# EAGLE design balanced_detector_pcb (EAGLE 5.06)
COST: 0.14; DIELECTRIC: X7R; MFG: PANASONIC; MPN: ERJ-3EKF2002V; PRICE: 0.15; SHT_NAME: BALANCED DETECTOR; VENDOR: DIGIKEY; VOLTAGE: 50V; VPN: P20.0KHCT-ND
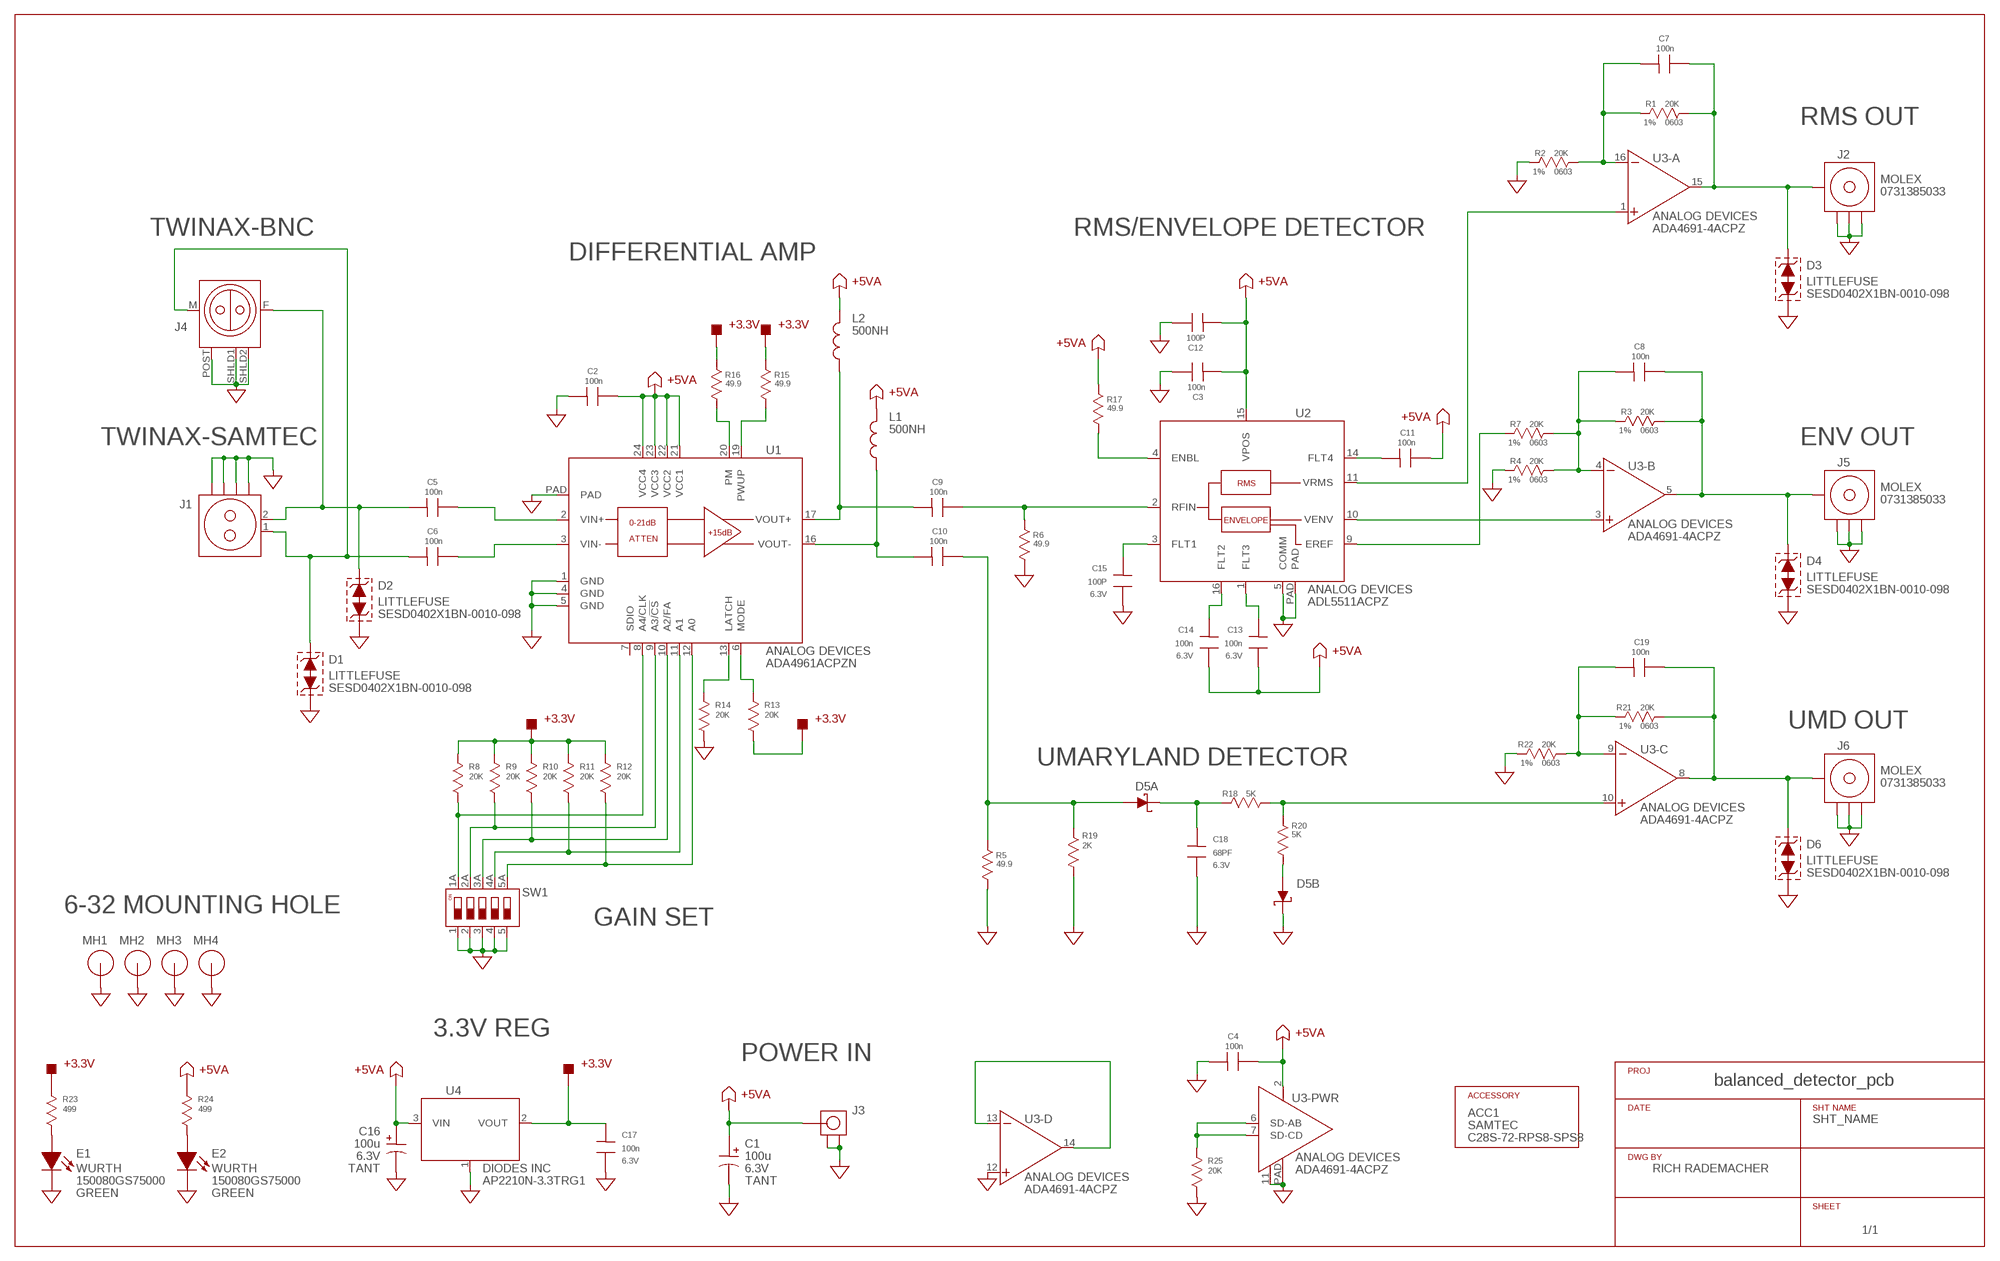
[diagram p0: schematic, sheet 1]
ACC1 (CABLE_SAMTEC_C28S): MFG: SAMTEC; MPN: C28S-72-RPS8-SPS8; VENDOR: SAMTEC; VPN: C28S-72-RPS8-SPS8
U$1 (TITLEBLOCK): AUTHOR: RICH RADEMACHER; DO_NOT_BOM: TRUE; SHT_NAME: SHT_NAME

## Parts
C1  100u  CAP-POL-SIZED  [CAP-SIZE_D/E_EIA7343]
C2  100n  CAP-NP-0603  [R-0603]
C3  100n  CAP-NP-0603  [R-0603]
C4  100n  CAP-NP-0603  [R-0603]
C5  100n  CAP-NP-0603  [R-0603]
C6  100n  CAP-NP-0603  [R-0603]
C7  100n  CAP-NP-0603  [R-0603]
C8  100n  CAP-NP-0603  [R-0603]
C9  100n  CAP-NP-0603  [R-0603]
C10  100n  CAP-NP-0603  [R-0603]
C11  100n  CAP-NP-0603  [R-0603]
C12  100P  CAP-NP-0603  [R-0603]
C13  100n  CAP-NP-0603  [R-0603]
C14  100n  CAP-NP-0603  [R-0603]
C15  100P  CAP-NP-0603  [R-0603]
C16  100u  CAP-POL-SIZED  [CAP-SIZE_D/E_EIA7343]
C17  100n  CAP-NP-0603  [R-0603]
C18  68PF  CAP-NP-0603  [R-0603]
C19  100n  CAP-NP-0603  [R-0603]
D1  TVS_SESD0402  [0402-DFN]
D2  TVS_SESD0402  [0402-DFN]
D3  TVS_SESD0402  [0402-DFN]
D4  TVS_SESD0402  [0402-DFN]
D5  SCHOTTKY-DUAL-BAT15099  [SOT143]
D6  TVS_SESD0402  [0402-DFN]
E1  LED-0805-GRN  [LED-0805]
E2  LED-0805-GRN  [LED-0805]
J1  CONN_TWINAX_CJT  [CJT-T-P-HH-RA-BH1]
J2  CONN_BNC_RA  [MOLEX_0731385033]
J3  CONN_RCA-BLACK-BLK  [CUI_RCJ-02X]
J4  CON-TWINAX-BNC  [TE_5228686-1]
J5  CONN_BNC_RA  [MOLEX_0731385033]
J6  CONN_BNC_RA  [MOLEX_0731385033]
L1  500NH  INDUCTOR-0805HT  [L-0805HT]
L2  500NH  INDUCTOR-0805HT  [L-0805HT]
MH1  MTG-HOLE  [MTG-4-40]
MH2  MTG-HOLE  [MTG-4-40]
MH3  MTG-HOLE  [MTG-4-40]
MH4  MTG-HOLE  [MTG-4-40]
R1  20K  RESISTOR-0603  [R-0603]
R2  20K  RESISTOR-0603  [R-0603]
R3  20K  RESISTOR-0603  [R-0603]
R4  20K  RESISTOR-0603  [R-0603]
R5  49.9  RESISTOR-0603  [R-0603]
R6  49.9  RESISTOR-0603  [R-0603]
R7  20K  RESISTOR-0603  [R-0603]
R8  20K  RESISTOR-0603  [R-0603]
R9  20K  RESISTOR-0603  [R-0603]
R10  20K  RESISTOR-0603  [R-0603]
R11  20K  RESISTOR-0603  [R-0603]
R12  20K  RESISTOR-0603  [R-0603]
R13  20K  RESISTOR-0603  [R-0603]
R14  20K  RESISTOR-0603  [R-0603]
R15  49.9  RESISTOR-0603  [R-0603]
R16  49.9  RESISTOR-0603  [R-0603]
R17  49.9  RESISTOR-0603  [R-0603]
R18  5K  RESISTOR-0603  [R-0603]
R19  2K  RESISTOR-0603  [R-0603]
R20  5K  RESISTOR-0603  [R-0603]
R21  20K  RESISTOR-0603  [R-0603]
R22  20K  RESISTOR-0603  [R-0603]
R23  499  RESISTOR-0603  [R-0603]
R24  499  RESISTOR-0603  [R-0603]
R25  20K  RESISTOR-0603  [R-0603]
SW1  SW-DIP-5PIN  [CTS_219-5MST]
U1  AMP_ADA4961  [LFCSP_24]
U2  DET_ADL5511  [LFCSP_16]
U3  OPAMP_ADA4691-4  [LFCSP_16]
U4  REG_AP2210_3.3V  [SOT23-3]

## Nets
+3.3V: C17.A R8.B R9.B R10.B R11.B R12.B R13.A R15.A R16.A R23.B U4.2(VOUT)
+5VA: C1.+ C2.B C3.A C4.B C11.B C12.A C13.B C14.B C16.+ J3.PIN L1.2 L2.2 R17.A R24.B U1.21(VCC1) U1.22(VCC2) U1.23(VCC3) U1.24(VCC4) U2.15(VPOS) U3.2(-PWR:V+) U4.3(VIN)
AGND: C1.- C2.A C3.B C4.A C12.B C15.B C16.- C17.B C18.B D1.2 D2.2 D3.2 D4.2 D5.3(B:K) D6.2 E1.K E2.K J1.GND1(GND) J1.GND2(GND) J1.GND3(GND) J1.GND4(GND) J2.GND J2.GND@1(GND) J2.GND@2(GND) J3.GND@1 J3.GND@2 J4.POST(GND) J4.SHLD1(GND) J4.SHLD2(GND) J5.GND J5.GND@1(GND) J5.GND@2(GND) J6.GND J6.GND@1(GND) J6.GND@2(GND) MH1.P$1 MH2.P$1 MH3.P$1 MH4.P$1 R2.A R4.A R5.B R6.B R14.A R19.B R22.A R25.A SW1.1 SW1.2 SW1.3 SW1.4 SW1.5 U1.1(GND) U1.4(GND) U1.5(GND) U1.PAD U2.5(COMM) U2.PAD U3.11(-PWR:V-) U3.12(-D:+IN) U3.PAD(-PWR:PAD) U4.1(GND)
N$1: C6.B U1.3(VIN-)
N$2: C5.B U1.2(VIN+)
N$3: C5.A D2.1 J1.2 J4.F
N$4: C6.A D1.1 J1.1 J4.M
N$5: C7.B D3.1 J2.PIN R1.B U3.15(-A:OUT)
N$6: C8.B D4.1 J5.PIN R3.B U3.5(-B:OUT)
N$7: U2.10(VENV) U3.3(-B:+IN)
N$8: U3.13(-D:-IN) U3.14(-D:OUT)
N$9: C19.A R21.A R22.B U3.9(-C:-IN)
N$10: U2.11(VRMS) U3.1(-A:+IN)
N$11: C8.A R3.A R4.B R7.B U3.4(-B:-IN)
N$12: C7.A R1.A R2.B U3.16(-A:-IN)
N$13: C9.B R6.A U2.2(RFIN)
N$14: C9.A L2.1 U1.17(VOUT+)
N$15: C10.A L1.1 U1.16(VOUT-)
N$16: C10.B D5.4(A:A) R5.A R19.A
N$17: R8.A SW1.1A U1.8(A4/CLK)
N$18: C11.A U2.14(FLT4)
N$19: R7.A U2.9(EREF)
N$20: C14.A U2.16(FLT2)
N$21: C13.A U2.1(FLT3)
N$22: C15.A U2.3(FLT1)
N$23: R9.A SW1.2A U1.9(A3/!CS)
N$24: R10.A SW1.3A U1.10(A2/FA)
N$25: R11.A SW1.4A U1.11(A1)
N$26: R12.A SW1.5A U1.12(A0)
N$27: R17.B U2.4(ENBL)
N$28: R14.B U1.13(LATCH)
N$29: R13.B U1.6(MODE)
N$30: D5.2(B:A) R20.B
N$31: R16.B U1.20(PM)
N$32: R15.B U1.19(PWUP)
N$33: C18.A D5.1(A:K) R18.A
N$34: R18.B R20.A U3.10(-C:+IN)
N$35: E1.A R23.A
N$36: E2.A R24.A
N$37: R25.B U3.6(-PWR:SD-AB) U3.7(-PWR:SD-CD)
N$39: C19.B D6.1 J6.PIN R21.B U3.8(-C:OUT)
Unconnected: U1.7(SDIO)

## Notes on the sheet
- RMS OUT
- TWINAX-BNC | RMS/ENVELOPE DETECTOR
- DIFFERENTIAL AMP
- TWINAX-SAMTEC | ENV OUT
- UMD OUT
- UMARYLAND DETECTOR
- 6-32 MOUNTING HOLE
- GAIN SET
- 3.3V REG
- POWER IN

## Library data of the parts
C1 C16 = balanced_detector_pcb:CAP-POL; COST: 1.50; DIELECTRIC: TANT; MFG: AVX; MPN: TAJD-SERIES; SOLIDMODEL: CAP_TANT_SIZE_D.G; SOLIDWORKS_CONFIG: SIZE_D; SOLIDWORKS_FILE: TantalumCap.SLDASM; VENDOR: DIGIKEY; VOLTAGE: 6.3V
C2-C15 C17-C19 = balanced_detector_pcb:CAP-NP; COST: 0.074; DIELECTRIC: X5R; SOLIDMODEL: CAP_NP_0603.g; SOLIDWORKS_CONFIG: SIZE_0603; SOLIDWORKS_FILE: ChipCapacitor.SLDASM; VOLTAGE: 6.3V
D1-D4 D6 = balanced_detector_pcb:TVS_SESD0402: TVS DIODE 7VWM 10VC DFN, 0.1pF @ 3GHz; MFG: LITTLEFUSE; MPN: SESD0402X1BN-0010-098; PRICE: 0.68; VENDOR: DIGIKEY; VPN: SESD0402X1BN-0010-098CT-ND
D5 = balanced_detector_pcb:SCHOTTKY-DUAL-BAT15099: Silicon Schottky Diodes ? Low barrier type for DBS mixer applications up to 12 GHz, phase detectors and modulators ? Low noise figure ? Pb-free (RoHS compliant) package; MFG: INFINEON; MPN: BAT15099; PRICE: 0.87; VENDOR: DIGIKEY; VPN: BAT15099E6327HTSA1CT-ND
E1 E2 = balanced_detector_pcb:LED-0805; COLOR: GREEN; MFG: WURTH; MPN: 150080GS75000; PRICE: 0.24; VENDOR: DIGIKEY; VPN: 732-4983-1-ND
J1 = balanced_detector_pcb:CONN_TWINAX_CJT: Circular RF Twinax Jack, Bulkhead Through-hole; MFG: SAMTEC; MPN: CJT-T-P-HH-RA-BH1; PRICE: 169.01; VENDOR: DIGIKEY; VPN: SAM9214-ND
J2 J5 J6 = balanced_detector_pcb:CONN_BNC_RA: CONN BNC RCPT R/A 50 OHM PCB; MFG: MOLEX; MPN: 0731385033; PRICE: 3.75; VENDOR: DIGIKEY; VPN: WM5515-ND
J3 = balanced_detector_pcb:CONN_RCA: VERTICAL THROUGH HOLE RCA JACK FEMALE; COLOR: BLK; MFG: CUI INC; MPN: RCJ-021; PRICE: 0.88; VENDOR: DIGIKEY; VPN: CP-1406-ND
J4 = balanced_detector_pcb:CON-TWINAX-BNC: CONN BNC TWIN JACK R/A PCB; MFG: TE CONNECTIVITY; MPN: 5228686-1; PRICE: 14.86; VENDOR: DIGIKEY; VPN: A32412-ND
L1 L2 = balanced_detector_pcb:INDUCTOR: 0805HT (2012) Ceramic Chip Inductors Our lowest profile 0805 chip inductors only 0.035" high! Inductance values from 1.8 nH to 150 nH (tolerances as low as 5%) Exceptionally high Q compared to non-wirewound inductors, especially at high frequencies Ceramic construction for highest possible self resonance (up to 11,500 MHz) RoHS Compliant. 260°C compatible. Silver-palladium-platinum-glass frit terminations. COTS Plus tin-silver-copper and tin-lead terminations available Samples of most 5% parts are available in Coilcraft Designer's Kit C321; MFG: COILCRAFT; MPN: 0805HT; PRICE: 0.79; TOLERANCE: 5%; VENDOR: COILCRAFT; VPN: 8085HT
MH1-MH4 = balanced_detector_pcb:MTG-HOLE; DO_NOT_BOM: TRUE
R1-R25 = balanced_detector_pcb:RESISTOR; PACKAGE: 0603; PRICE: .059; SOLIDMODEL: res0603.g; SOLIDWORKS_CONFIG: SIZE_0603; SOLIDWORKS_FILE: ChipResistor.SLDASM; TOLERANCE: 1%
SW1 = balanced_detector_pcb:SW-DIP-5PIN: CTS SERIES 219 DIP SWITCH; MFG: CTS; MPN: 219-5MST; PRICE: 1.17; VENDOR: DIGIKEY; VPN: CT2195MST-ND
U1 = balanced_detector_pcb:AMP_ADA4961: Low Distortion, 3.2 GHz, RF DGA; MFG: ANALOG DEVICES; MPN: ADA4961ACPZN; PRICE: 35.64; VENDOR: DIGIKEY; VPN: ADA4961ACPZN-R7CT-ND
U2 = balanced_detector_pcb:DET_ADL5511: DC to 6 GHz Envelope and TruPwr RMS Detector; MFG: ANALOG DEVICES; MPN: ADL5511ACPZ; PRICE: 23.7; VENDOR: DIGIKEY; VPN: ADL5511ACPZ-R7CT-ND
U3 = balanced_detector_pcb:OPAMP_ADA4691-4: Low Power, 3.6 MHz, Low Noise, Rail-toRail Output, Operational Amplifiers; MFG: ANALOG DEVICES; MPN: ADA4691-4ACPZ; PRICE: 4.08; VENDOR: DIGIKEY; VPN: ADA4691-4ACPZ-RLCT-ND
U4 = balanced_detector_pcb:REG_AP2210_3.3V: 300mA RF ULDO REGULATOR 3.3V; MFG: DIODES INC; MPN: AP2210N-3.3TRG1; PRICE: 0.63; VENDOR: DIGIKEY; VPN: AP2210N-3.3TRG1DICT-ND

## Board
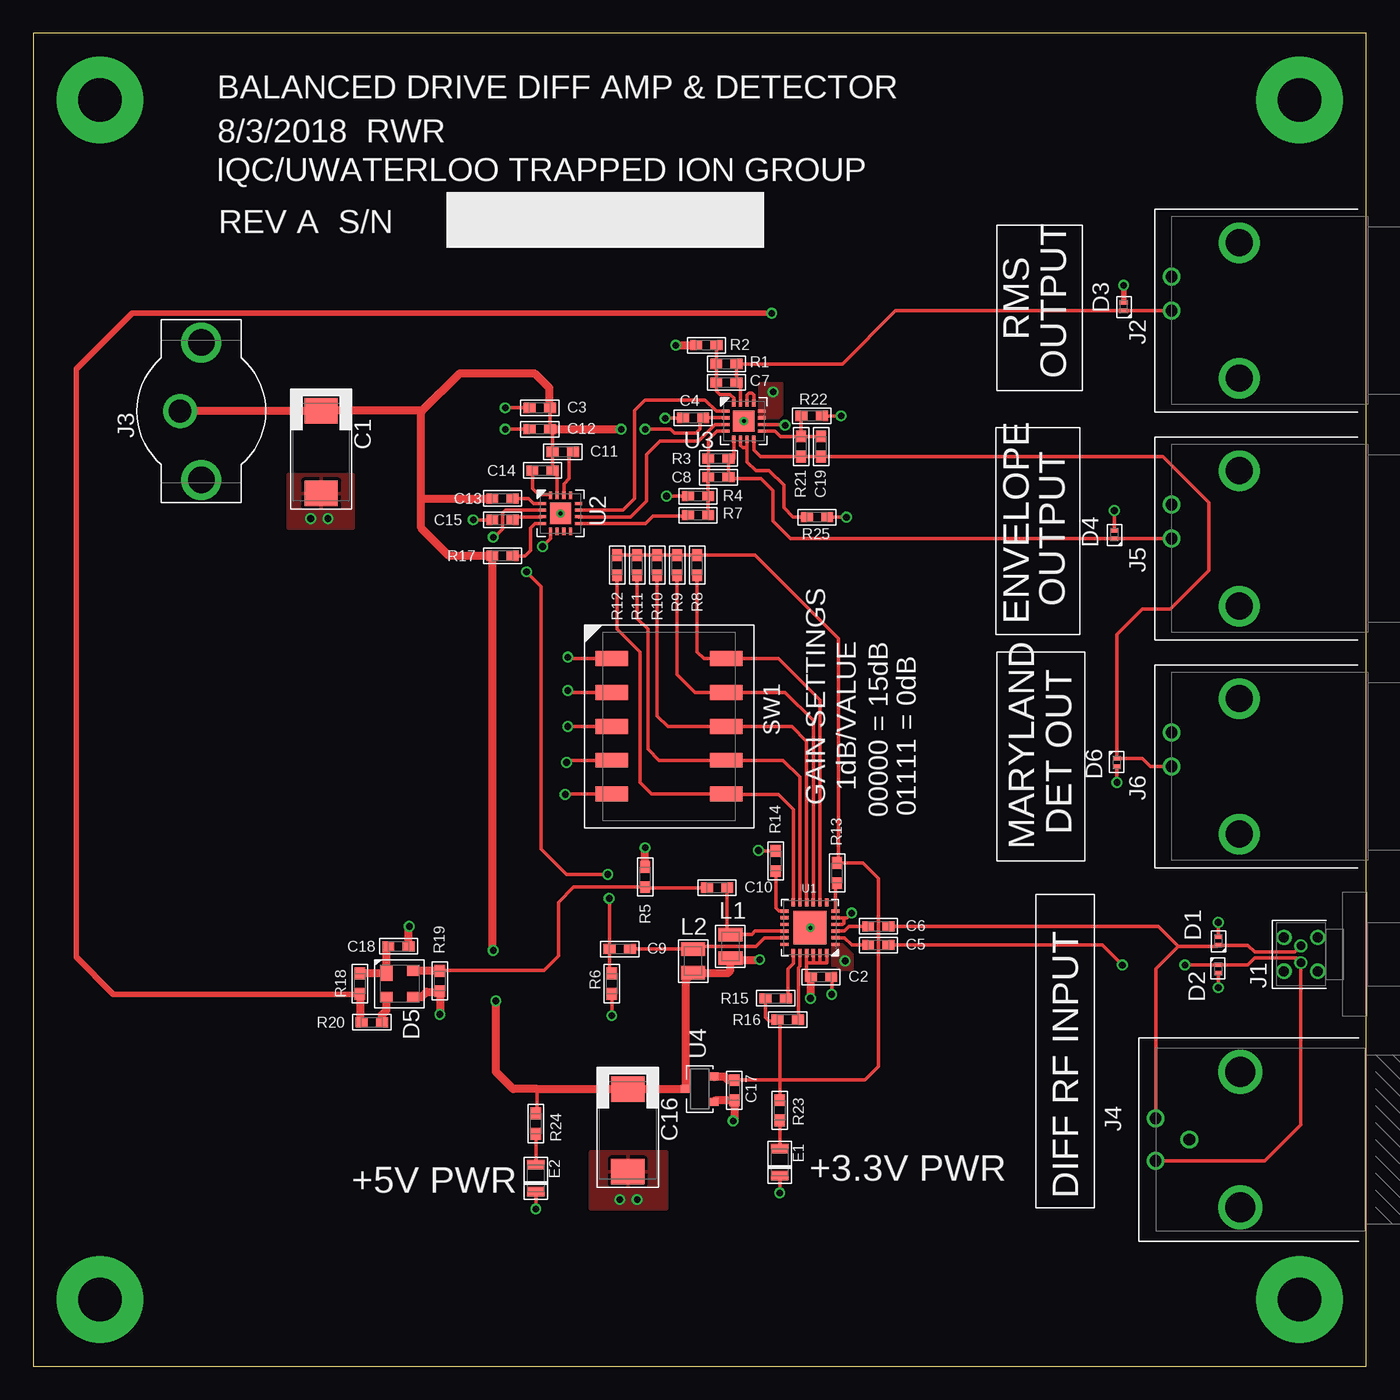
[diagram p1: board, top side]
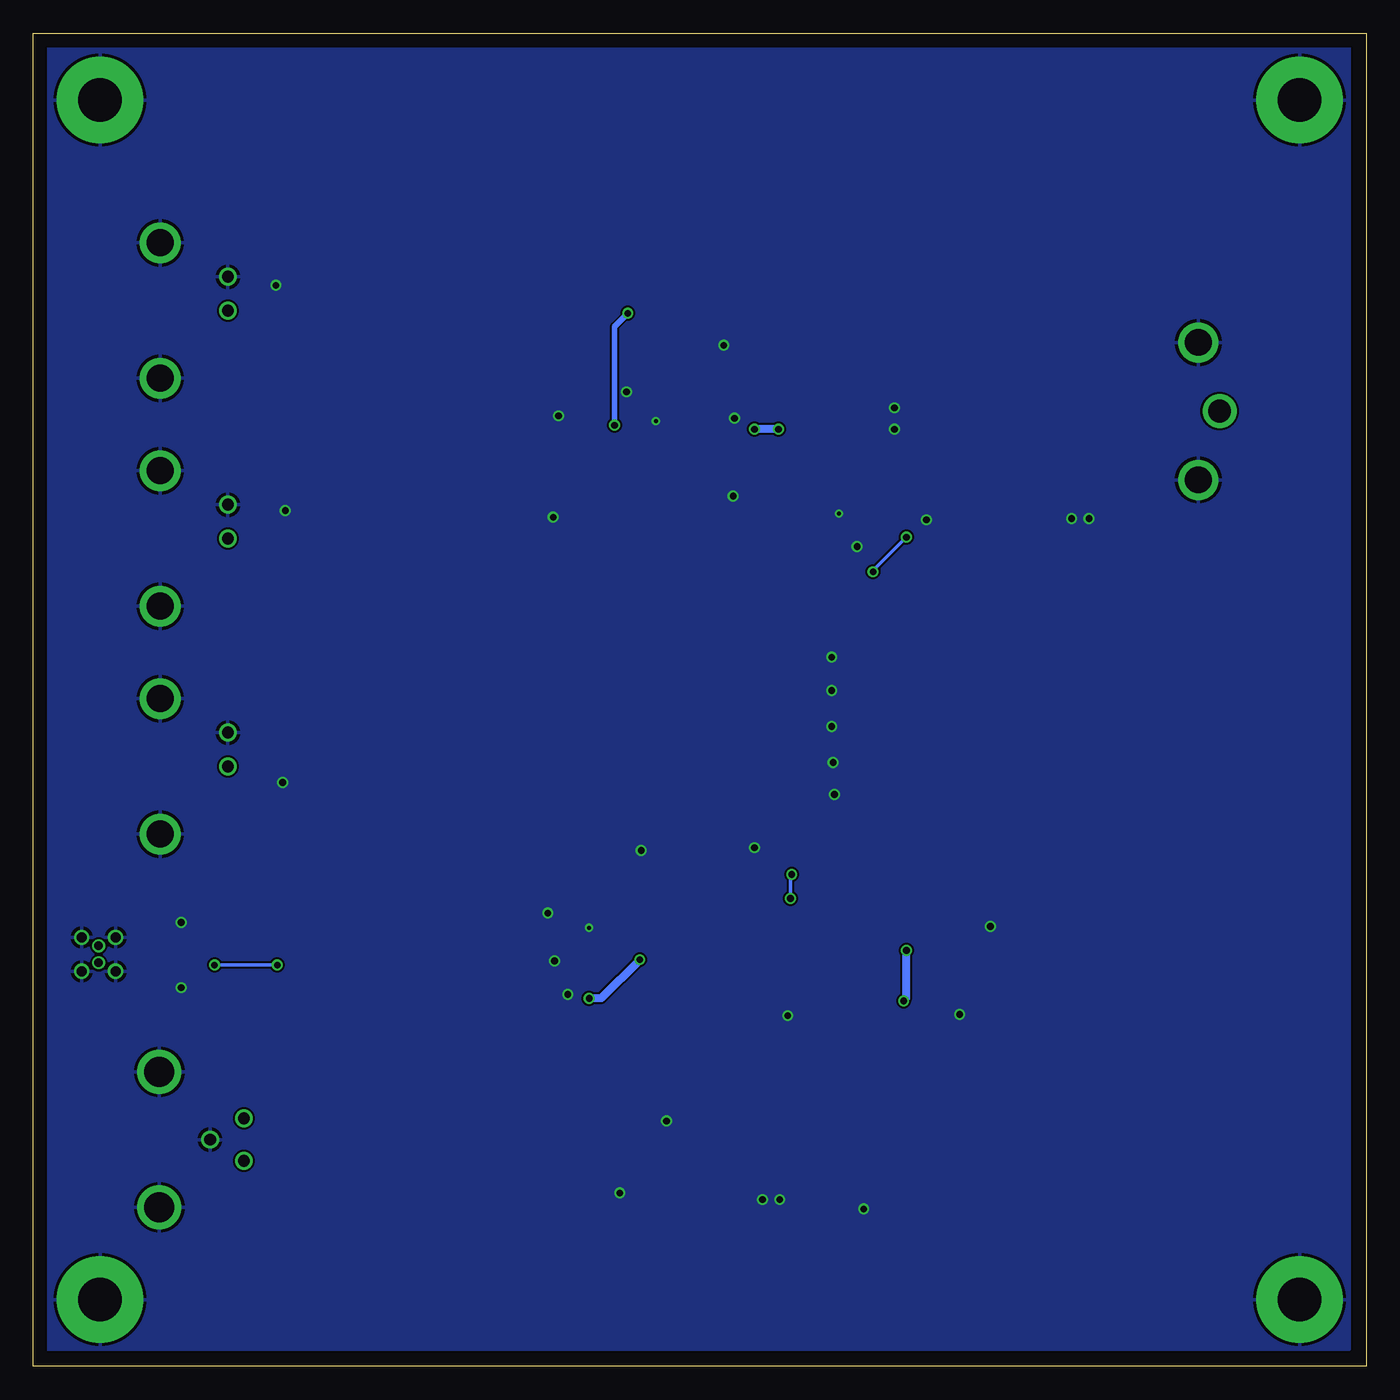
[diagram p2: board, bottom side, seen from below]

Size 100 x 100 mm. Coordinates in mm from the lower left corner, seen from the top.
Outline: 0,0 100,0 100,100 0,100 0,0
Copper layers (1+16): Top 0.035mm / dielectric 1.5mm / Bottom 0.035mm
Design rules "PCBWAY-2LAYER": minimum track width 4mil, minimum drill 0.2007mm, track to track 6mil, track to pad 6mil, pad to pad 6mil, via to via 6mil, smd to smd 6mil, copper to edge 40mil, drill to drill 8mil, minimum pad ring 6mil, minimum via ring 6mil, stop-mask expansion 4mil, vias tented up to drill 0mil, thermal gap 10mil
Milling: 4 lines

### Footprints (pad centres in the part's own frame; a part is rotated, then mirrored left to right if it is on the bottom)
CAP-SIZE_D/E_EIA7343 = smd 1.9 x 2.5: + -3.1,0; - 3.1,0
R-0603 = smd 0.889 x 0.762: A -0.762,0; B 0.762,0
0402-DFN = smd 0.61 x 0.356: 1 0,0.318; 2 0,-0.318
SOT143 = smd 1.2 x 0.9: 1 -0.8,-1 | smd 0.8 x 0.9: 2 1,-1; 3 1,1; 4 -1,1
LED-0805 = smd 0.711 x 1.321: A -1.016,0; K 1.016,0
CJT-T-P-HH-RA-BH1 = drill 0.635 round: 1 -0.635,0; 2 0.635,0 | drill 0.762 round: GND1 -1.27,1.27; GND2 1.27,1.27; GND3 -1.27,-1.27; GND4 1.27,-1.27
MOLEX_0731385033 = drill 0.889 round: GND -2.54,0; PIN 0,0 | drill 2.032 round: GND@1 -5.08,5.08; GND@2 5.08,5.08
CUI_RCJ-02X = drill 2 round: GND@1 -5.15,0; GND@2 5.15,0 | drill 1.7 round: PIN 0,1.6
TE_5228686-1 = drill 0.889 round: F 1.6,0; M -1.6,0; POST 0,2.54 | drill 2.261 round: SHLD1 -5.08,6.35; SHLD2 5.08,6.35
L-0805HT = smd 1.016 x 1.778: 1 -0.889,0; 2 0.889,0
MTG-4-40 = drill 3.264 pad 6.452 round: P$1 0,0
CTS_219-5MST = smd 1.118 x 2.438: 1 -5.08,-4.305; 1A -5.08,4.305; 2 -2.54,-4.305; 2A -2.54,4.305; 3 0,-4.305; 3A 0,4.305; 4 2.54,-4.305; 4A 2.54,4.305; 5 5.08,-4.305; 5A 5.08,4.305
LFCSP_24 = smd 0.6 x 0.25: 1 -1.9,1.25; 2 -1.9,0.75; 3 -1.9,0.25; 4 -1.9,-0.25; 5 -1.9,-0.75; 6 -1.9,-1.25; 13 1.9,-1.25; 14 1.9,-0.75; 15 1.9,-0.25; 16 1.9,0.25; 17 1.9,0.75; 18 1.9,1.25 | smd 0.25 x 0.6: 7 -1.25,-1.9; 8 -0.75,-1.9; 9 -0.25,-1.9; 10 0.25,-1.9; 11 0.75,-1.9; 12 1.25,-1.9; 19 1.25,1.9; 20 0.75,1.9; 21 0.25,1.9; 22 -0.25,1.9; 23 -0.75,1.9; 24 -1.25,1.9 | smd 2.5 x 2.5: PAD 0,0
LFCSP_16 = smd 0.55 x 0.23: 1 -1.35,0.75; 2 -1.35,0.25; 3 -1.35,-0.25; 4 -1.35,-0.75; 9 1.35,-0.75; 10 1.35,-0.25; 11 1.35,0.25; 12 1.35,0.75 | smd 0.23 x 0.55: 5 -0.75,-1.35; 6 -0.25,-1.35; 7 0.25,-1.35; 8 0.75,-1.35; 13 0.75,1.35; 14 0.25,1.35; 15 -0.25,1.35; 16 -0.75,1.35 | smd 1.6 x 1.6: PAD 0,0
SOT23-3 = smd 0.6 x 0.7: 1 -0.95,-1.05; 2 0.95,-1.05; 3 0,1.05

### Placement (x,y rotation side)
C1  21.59,68.58 270 top
C2  59.1,29.2 180 top
C3  38,71.9 180 top
C4  49.5,71.15 0 top
C5  63.4,31.6 180 top
C6  63.4,33 180 top
C7  52,73.8 0 top
C8  51.4,66.7 0 top
C9  44,31.3 180 top
C10  51.3,35.9 180 top
C11  39.73,68.6 180 top
C12  38,70.3 180 top
C13  35.2,65.1 180 top
C14  38.2,67.2 0 top
C15  35.2,63.5 180 top
C16  44.6,17.7 270 top
C17  52.6,20.7 270 top
C18  27.4,31.5 0 top
C19  59.1,69 270 top
D1  88.9,31.9 180 top
D2  88.9,29.8 0 top
D3  81.8,79.5 180 top
D4  81.1,62.4 180 top
D5  27.5,28.7 270 top
D6  81.3,45.3 0 top
E1  56,15.3 270 top
E2  37.7,14.1 270 top
J1  95.1,30.9 270 top
J2  85.4,79.2 270 top
J3  12.6,71.65 90 top
J4  84.2,17 270 top
J5  85.4,62.1 270 top
J6  85.4,45 270 top
L1  52.3,31.5 270 top
L2  49.5,30.4 270 top
MH1  5,5 0 top
MH2  5,95 0 top
MH3  95,95 0 top
MH4  95,5 0 top
R1  52,75.2 0 top
R2  50.5,76.6 0 top
R3  51.4,68.1 0 top
R4  49.88,65.28 0 top
R5  45.9,36.7 90 top
R6  43.4,28.7 270 top
R7  49.88,63.85 0 top
R8  49.8,60.1 90 top
R9  48.3,60.1 90 top
R10  46.8,60.1 90 top
R11  45.3,60.1 90 top
R12  43.8,60.1 90 top
R13  60.3,37 270 top
R14  55.7,37.9 270 top
R15  55.7,27.6 0 top
R16  56.6,26 0 top
R17  35.2,60.8 0 top
R18  24.5,28.7 270 top
R19  30.5,28.9 270 top
R20  25.4,25.8 0 top
R21  57.6,69 270 top
R22  58.4,71.3 180 top
R23  56,19.2 90 top
R24  37.7,18.2 90 top
R25  58.8,63.7 180 top
SW1  47.7,48 270 top
U1  58.27,32.89 180 top
U2  39.55,63.98 0 top
U3  53.3,70.9 0 top
U4  50,20.8 90 top

### Tracks (layer width: path | path; a pad name or v marks a point on that pad's centre or on a via)
+3.3V
  Top 0.25: R12.B R11.B R10.B R9.B R8.B 54.14,60.86 60.4,54.6 60.4,37.86 R13.A 62.24,37.76 63.4,36.6 63.4,22.5 62.4,21.5 56,21.5 | C17.A 52.64,21.5 56,21.5 | 56,21.5 56,25.84 R16.A 55.74,25.9 55.2,25.9 54.94,26.16 R15.A | 56,21.5 R23.B
  Top 0.61: U4.2 51.1,21.7 51.9,21.7 52.14,21.46 C17.A
+5VA  (via drill 0.5)
  Top 0.25: U3.2 C4.B 50,70.89 50,70.3 49.7,70 48.1,70 47.8,70.3 v45.9,70.3 | C14.B 38.84,67.2 | C3.A C12.A 38.96,70.3 C11.B C14.B | U2.15 39.3,67.2 C14.B | 58.02,30.27 58.02,29.52 C2.B | 58.02,30.27 U1.21 | U1.23 59.02,30.35 | 59.02,30.35 58.95,30.27 58.52,30.27 | 58.02,30.27 58.52,30.27 | U1.22 58.52,30.27 | U1.24 59.52,30.27 59.05,30.27 59.02,30.35 | R24.B 37.8,19.06 37.8,20.8
  Top 0.61: J3.PIN 21.56,71.65 C1.+ 29,71.68 | 29,71.68 29.18,71.68 32,74.5 37.6,74.5 38.7,73.4 38.7,71.96 C3.A | 29.1,65.1 29.1,71.58 29,71.68 | 29.1,65.1 29.1,62.9 31.2,60.8 R17.A 34.44,31.26 v34.5,31.2 | 29.1,65.1 C13.B | 38.96,70.3 v44.1,70.3 | v34.7,27.4 34.7,22.1 36,20.8 37.8,20.8 C16.+ U4.3 48.95,29.15 49,29.2 49.19,29.2 L2.2 49.51,29.5 52.1,29.5 52.3,29.7 L1.2 52.41,30.5 v54.5,30.5 | v58.3,27.6 58.34,27.64 C2.B
  Bottom 0.61: v44.1,70.3 v45.9,70.3 | v34.5,31.2 34.5,27.6 v34.7,27.4 | v54.5,30.5 57.4,27.6 v58.3,27.6
AGND  (via drill 0.3, 0.5)
  Top 0.25: R22.A v60.6,71.3 | C4.A 48.71,71.12 v47.4,71.12 | v47.5,65.28 R4.A | v35.4,70.3 C12.B | v35.4,71.9 C3.B | v33,63.5 C15.B | D4.2 v81.1,64.2 | D6.2 v81.3,43.8 | SW1.5 39.92,42.92 v39.9,42.9 | SW1.4 40.16,45.46 v40,45.3 | v40.1,48 SW1.3 | SW1.2 40.26,50.54 v40.1,50.7 | SW1.1 40.22,53.08 v40.1,53.2 | v59.9,27.9 59.9,29.16 C2.A | U1.5 60.83,33.64 | 60.83,33.64 61.04,33.64 v61.4,34 | U1.4 60.71,33.14 60.83,33.23 60.83,33.64 | v58.3,32.9 U1.PAD | R14.A 54.44,38.66 v54.4,38.7 | D1.2 v88.9,33.3 | D2.2 v88.9,28.4 | R6.B v43.4,26.3 | U2.5 38.8,62.1 v38.2,61.5 | E1.K v56,13 | v37.7,11.8 E2.K | R25.A v61,63.7
  Top 0.4: D3.2 v81.8,81.1
  Top 0.61: D5.3 29.1,27.7 29.5,28.1 30.46,28.1 R19.B v30.5,26.4 | C18.B 28.16,32.96 v28.2,33 | U4.1 51.14,19.94 C17.B 52.6,18.5 v52.5,18.4 | R5.B v45.9,38.9 | v48.2,76.6 R2.A | U2.PAD 39.53,64 U2.PAD
  other vias: 53.3,70.9 39.55,63.98 20.8,63.6 22.1,63.6 44,12.5 45.3,12.5 60.9,30.4 55.5,73.1
  pour Bottom: 1.27,1.27 99.06,1.27 99.06,99.06 1.27,99.06
  pour Top (no thermals): 54.45,71.1 55.9,71.1 56.2,71.4 56.2,73.8 54.45,73.8
  pour Top: 41.8,16.1 41.8,11.8 47.5,11.8 47.5,16.1
  pour Top: 19.1,66.9 19.1,62.9 24,62.9 24,66.9
  pour Top (no thermals): 61.5,29.8 61.5,30.9 60.7,31.7 59.9,31.7 59.9,30 60.3,30 60.6,29.7 61.4,29.7
N$1
  Top 0.25: U1.3 60.84,32.64 61.2,33 C6.B
N$2
  Top 0.25: U1.2 60.86,32.14 61.4,31.6 C5.B
N$3  (via drill 0.5)
  Top 0.25: J4.F 92.4,15.4 95.1,18.1 J1.2 94.74,30.62 91.62,30.62 91.12,30.12 D2.1 86.42,30.12 v86.4,30.1 | v81.7,30.1 80.2,31.6 C5.A
  Bottom 0.25: v81.7,30.1 v86.4,30.1
N$4
  Top 0.25: J4.M 84.2,29.8 85.9,31.5 | 85.9,31.5 88.82,31.5 D1.1 91.12,31.58 91.62,31.07 94.64,31.07 J1.1 | C6.A 84.4,33 85.9,31.5
N$5
  Top 0.25: U3.15 53.05,73.8 C7.B R1.B 60.7,75.2 64.68,79.18 D3.1 81.82,79.2 J2.PIN
N$6
  Top 0.25: U3.5 52.55,68.1 R3.B C8.B 52.26,66.6 54.6,66.6 55.5,65.7 55.5,63.4 56.82,62.08 D4.1 81.12,62.1 J5.PIN
N$7
  Top 0.25: U3.3 51.15,70.65 49.9,69.4 47,69.4 46,68.4 46,64.92 44.8,63.73 U2.10
N$8
  Top 0.25: U3.13 54.05,72.85 53.9,73 53.7,73 53.55,72.85 U3.14
N$9
  Top 0.25: U3.9 55.65,70.15 56.04,69.76 R21.A | R21.A C19.A | R22.B 57.6,71.26 R21.A
N$10
  Top 0.25: U2.11 44.23,64.23 45.1,65.1 45.1,71.7 45.9,72.5 50.4,72.5 51.25,71.65 U3.1
N$11
  Top 0.25: U3.4 51.27,70.15 50.64,69.51 R3.A C8.A R4.B R7.B
N$12
  Top 0.25: R2.B 51.24,76.6 R1.A C7.A 51.24,73.16 51.5,72.9 52.27,72.9 52.55,72.62 U3.16
N$13  (via drill 0.5)
  Top 0.25: R6.A 43.24,29.62 C9.B 43.24,35.06 v43.2,35.1 | v43.1,36.9 40,36.9 38.1,38.8 38.1,58.5 v37,59.6 | v34.5,62.2 34.6,62.2 35.2,62.8 35.2,64 35.43,64.23 U2.2
  Bottom 0.25: v43.2,35.1 43.2,36.8 v43.1,36.9 | v37,59.6 37,59.7 v34.5,62.2
N$14
  Top 0.25: U1.17 54.84,32.14 54.2,31.5 50.1,31.5 50,31.4 49.61,31.4 L2.1 44.77,31.29 C9.A
N$15
  Top 0.25: U1.16 54.14,32.64 53.9,32.4 L1.1 52.06,32.63 C10.A
N$16
  Top 0.25: C10.B 45.94,35.9 R5.A 40.54,35.94 39.4,34.8 39.4,30.8 38.3,29.7 30.54,29.7 R19.A
  Top 0.61: D5.4 30.46,29.7 R19.A
N$17
  Top 0.25: U1.8 59.02,49.98 55.9,53.1 52.02,53.1 | 52.02,53.1 SW1.1A | 52.02,53.1 50.3,53.1 49.8,53.6 R8.A
N$18
  Top 0.25: U2.14 39.8,66.2 40.2,66.6 40.2,68.6 C11.A
N$19
  Top 0.25: U2.9 45.93,63.23 46.5,63.8 49.06,63.8 R7.A
N$20
  Top 0.25: U2.16 38.8,65.4 37.9,65.4 37.44,65.86 C14.A
N$21
  Top 0.25: U2.1 37.52,64.72 37.15,65.1 C13.A
N$22
  Top 0.25: U2.3 38.17,63.7 35.96,63.7 C15.A
N$23
  Top 0.25: U1.9 58.52,48.43 56.4,50.55 SW1.2A 49.66,50.54 48.3,51.9 R9.A
N$24
  Top 0.25: U1.10 58.02,46.88 56.9,48 SW1.3A 47.6,48 46.8,48.8 R10.A
N$25
  Top 0.25: U1.11 57.5,34.81 57.5,44.2 56.24,45.46 SW1.4A 46.94,45.46 46.1,46.3 46.1,55.3 45.3,56.1 R11.A
N$26
  Top 0.25: U1.12 57.02,41.78 55.9,42.9 52.02,42.9 SW1.5A 46.38,42.92 45.5,43.8 45.5,53.6 43.8,55.3 R12.A
N$27
  Top 0.25: U2.4 37.63,63.23 37.3,62.9 37.3,61.2 36.9,60.8 R17.B
N$28
  Top 0.25: U1.13 55.96,34.14 55.7,34.4 R14.B
N$29
  Top 0.25: U1.6 60.17,36.11 R13.B
N$30
  Top 0.61: R20.B 26.16,26.36 26.5,26.7 D5.2
N$31
  Top 0.25: U1.20 57.52,30.02 57.4,29.9 57.4,26.04 R16.B
N$32
  Top 0.25: U1.19 57.02,30.22 56.6,29.8 56.6,27.74 R15.B
N$33
  Top 0.61: C18.A 26.5,31.36 D5.1 24.54,29.5 R18.A
N$34  (via drill 0.5)
  Top 0.25: U3.10 56.35,70.65 v56.4,70.6
  Top 0.406: v55.4,79 7.4,79 3.2,74.8 3.2,30.7 6,27.9 24.46,27.9 R18.B
  Top 0.61: R18.B 24.5,25.94 R20.A
  Bottom 0.406: v56.4,70.6 56.4,78 v55.4,79
N$35
  Top 0.25: E1.A R23.A
N$36
  Top 0.25: E2.A R24.A
N$37
  Top 0.25: R25.B 57,63.7 56.3,64.4 56.3,66.1 55.2,67.2 54.2,67.2 53.55,67.85 53.55,68.9 | 53.55,68.9 U3.7 | U3.6 53.05,69.08 53.23,68.9 53.55,68.9
N$39
  Top 0.25: U3.8 54.08,69.53 54.08,68.72 54.56,68.24 R21.B C19.B 84.76,68.24 88.2,64.8 88.2,59.7 85.3,56.8 83.2,56.8 81.3,54.9 D6.1 81.32,45.6 83.2,45.6 83.8,45 J6.PIN

### Text on the board
tPlace: BALANCED DRIVE DIFF AMP & DETECTOR | 8/3/2018 RWR | IQC/UWATERLOO TRAPPED ION GROUP | REV A S/N | RMS | OUTPUT | OUTPUT | ENVELOPE | 1dB/VALUE | GAIN SETTINGS | 00000 = 15dB | 01111 = 0dB | DET OUT | MARYLAND | +5V PWR | +3.3V PWR | DIFF RF INPUT